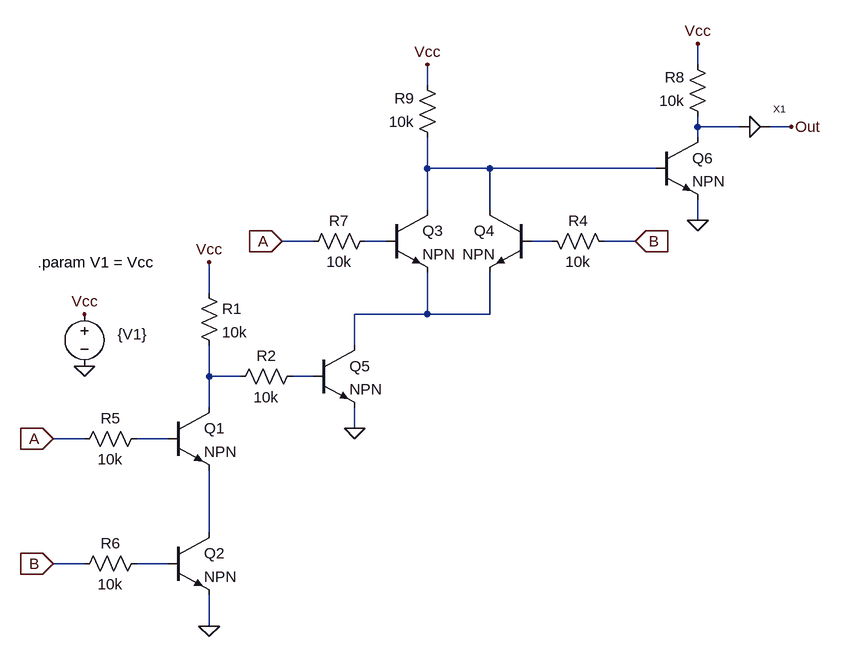
[diagram p0: schematic XOR.asc]
XOR.asc, the LTspice schematic file:
Version 4
SHEET 1 1388 680
WIRE 1136 -416 1136 -448
WIRE 720 -384 720 -416
WIRE 1136 -320 1136 -336
WIRE 1200 -320 1136 -320
WIRE 1280 -320 1248 -320
WIRE 1136 -304 1136 -320
WIRE 720 -256 720 -304
WIRE 816 -256 720 -256
WIRE 1072 -256 816 -256
WIRE 720 -192 720 -256
WIRE 816 -192 816 -256
WIRE 1136 -176 1136 -208
WIRE 544 -144 496 -144
WIRE 656 -144 624 -144
WIRE 912 -144 880 -144
WIRE 1040 -144 992 -144
WIRE 384 -64 384 -112
WIRE 720 -32 720 -96
WIRE 720 -32 608 -32
WIRE 816 -32 816 -96
WIRE 816 -32 720 -32
WIRE 608 16 608 -32
WIRE 384 64 384 16
WIRE 432 64 384 64
WIRE 544 64 512 64
WIRE 384 112 384 64
WIRE 608 144 608 112
WIRE 192 160 144 160
WIRE 320 160 272 160
WIRE 384 304 384 208
WIRE 192 352 144 352
WIRE 320 352 272 352
WIRE 384 448 384 400
FLAG 496 -144 A
IOPIN 496 -144 In
FLAG 144 160 A
IOPIN 144 160 In
FLAG 144 352 B
IOPIN 144 352 In
FLAG 1040 -144 B
IOPIN 1040 -144 In
FLAG 1280 -320 Out
FLAG 608 144 0
FLAG 384 448 0
FLAG 1136 -176 0
FLAG 1136 -448 Vcc
FLAG 720 -416 Vcc
FLAG 384 -112 Vcc
FLAG 192 -32 Vcc
FLAG 192 48 0
SYMBOL npn 320 112 R0
SYMATTR InstName Q1
SYMBOL npn 320 304 R0
SYMATTR InstName Q2
SYMBOL npn 656 -192 R0
SYMATTR InstName Q3
SYMBOL npn 880 -192 M0
SYMATTR InstName Q4
SYMBOL npn 544 16 R0
SYMATTR InstName Q5
SYMBOL res 368 -80 R0
SYMATTR InstName R1
SYMATTR Value 10k
SYMBOL res 528 48 R90
WINDOW 0 0 56 VBottom 2
WINDOW 3 32 56 VTop 2
SYMATTR InstName R2
SYMATTR Value 10k
SYMBOL res 896 -160 M90
WINDOW 0 0 56 VBottom 2
WINDOW 3 32 56 VTop 2
SYMATTR InstName R4
SYMATTR Value 10k
SYMBOL res 288 144 R90
WINDOW 0 0 56 VBottom 2
WINDOW 3 32 56 VTop 2
SYMATTR InstName R5
SYMATTR Value 10k
SYMBOL res 288 336 R90
WINDOW 0 0 56 VBottom 2
WINDOW 3 32 56 VTop 2
SYMATTR InstName R6
SYMATTR Value 10k
SYMBOL res 640 -160 R90
WINDOW 0 0 56 VBottom 2
WINDOW 3 32 56 VTop 2
SYMATTR InstName R7
SYMATTR Value 10k
SYMBOL res 736 -288 R180
WINDOW 0 36 76 Left 2
WINDOW 3 36 40 Left 2
SYMATTR InstName R9
SYMATTR Value 10k
SYMBOL npn 1072 -304 R0
SYMATTR InstName Q6
SYMBOL res 1152 -320 R180
WINDOW 0 36 76 Left 2
WINDOW 3 36 40 Left 2
SYMATTR InstName R8
SYMATTR Value 10k
SYMBOL Buffer 1200 -320 R0
SYMATTR InstName X1
SYMBOL voltage 192 -48 R0
WINDOW 0 24 16 Invisible 2
WINDOW 3 51 47 Left 2
SYMATTR InstName V1
SYMATTR Value {V1}
TEXT 120 -112 Left 2 !.param V1 = Vcc

The netlist it stands for:
* XOR.asc
Q1 N006 N008 N009 0 NPN
Q2 N009 N010 0 0 NPN
Q3 N002 N003 N005 0 NPN
Q4 N002 N004 N005 0 NPN
Q5 N005 N007 0 0 NPN
R1 Vcc N006 10k
R2 N007 N006 10k
R4 N004 B 10k
R5 N008 A 10k
R6 N010 B 10k
R7 N003 A 10k
R9 N002 Vcc 10k
Q6 N001 N002 0 0 NPN
R8 N001 Vcc 10k
XX1 N001 Out Buffer Vcc = 5V  ; pins In Out
V1 Vcc 0 {V1}
.model NPN NPN
.model PNP PNP
.lib standard.bjt
.param V1 = Vcc
.backanno
.end